# EAGLE design Schematic Final (EAGLE 9.2.2)
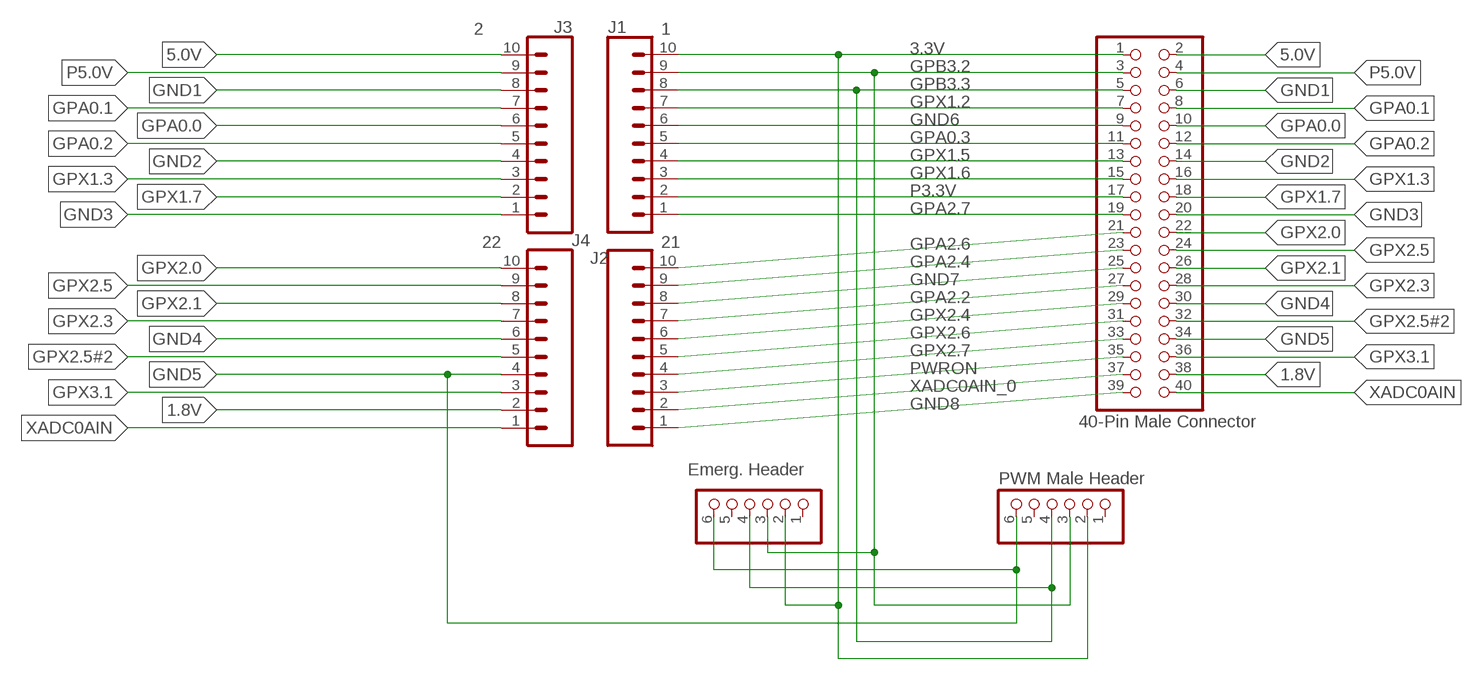
[diagram p0: schematic, sheet 1]

## Parts
J1  1  CONN_10"  [1X10]
J2  21  CONN_10"  [1X10]
J3  2  CONN_10"  [1X10]
J4  22  CONN_10"  [1X10]
JP1  40-Pin Male Connector  PINHD-2X20  [2X20]
JP2  Emerg. Header  PINHD-1X6  [1X06]
JP4  PWM Male Header  PINHD-1X6  [1X06]

## Nets
1.8V: J4.2 JP1.38
3.3V: J1.10 JP1.1 JP2.2 JP4.2
5.0V: J3.10 JP1.2
GND1: J3.8 JP1.6
GND2: J3.4 JP1.14
GND3: J3.1 JP1.20
GND4: J4.6 JP1.30
GND5: J4.4 JP1.34 JP2.6 JP4.6
GND6: J1.6 JP1.9
GND7: J2.8 JP1.25
GND8: J2.1 JP1.39
GPA0.0: J3.6 JP1.10
GPA0.1: J3.7 JP1.8
GPA0.2: J3.5 JP1.12
GPA0.3: J1.5 JP1.11
GPA2.2: J2.7 JP1.27
GPA2.4: J2.9 JP1.23
GPA2.6: J2.10 JP1.21
GPA2.7: J1.1 JP1.19
GPB3.2: J1.9 JP1.3 JP2.3 JP4.3
GPB3.3: J1.8 JP1.5 JP2.4 JP4.4
GPX1.2: J1.7 JP1.7
GPX1.3: J3.3 JP1.16
GPX1.5: J1.4 JP1.13
GPX1.6: J1.3 JP1.15
GPX1.7: J3.2 JP1.18
GPX2.0: J4.10 JP1.22
GPX2.1: J4.8 JP1.26
GPX2.3: J4.7 JP1.28
GPX2.4: J2.6 JP1.29
GPX2.5: J4.9 JP1.24
GPX2.5#2: J4.5 JP1.32
GPX2.6: J2.5 JP1.31
GPX2.7: J2.4 JP1.33
GPX3.1: J4.3 JP1.36
P3.3V: J1.2 JP1.17
P5.0V: J3.9 JP1.4
PWRON: J2.3 JP1.35
XADC0AIN: J4.1 JP1.40
XADC0AIN_0: J2.2 JP1.37
Unconnected: JP2.1 JP2.5 JP4.1 JP4.5

## Library data of the parts
J1-J4 = SparkFun-Connectors:CONN_10: Multi connection point. Often used as Generic Header-pin footprint for 0.1 inch spaced/style header connections On any of the 0.1 inch spaced packages, you can populate with these: Break Away Headers - Straight <https://www.sparkfun.com/products/116> (PRT-00116) Break Away Male Headers - Right Angle <https://www.sparkfun.com/products/553> (PRT-00553) Female Headers <https://www.sparkfun.com/products/115> (PRT-00115) Break Away Headers - Machine Pin <https://www.sparkfun.com/products/117> (PRT-00117) Break Away Female Headers - Swiss Machine Pin <https://www.sparkfun.com/products/743> (PRT-00743) Arduino Stackable Header - 10 Pin <https://www.sparkfun.com/products/11376> (PRT-11376) For SCREWTERMINALS and SPRING TERMINALS visit here: Screw Terimnals on SparkFun.com <https://www.sparkfun.com/search/results?term=Screw+Terminals> (5mm/3.5mm/2.54mm spacing) This device is also useful as a general connection point to wire up your design to another part of your project. Our various solder wires solder well into these plated through hole pads. Hook-Up Wire - Assortment (Stranded, 22 AWG) <https://www.sparkfun.com/products/11375> (PRT-11375) Hook-Up Wire - Assortment (Solid Core, 22 AWG) <https://www.sparkfun.com/products/11367> (PRT-11367) View the entire wire category on our website here <https://www.sparkfun.com/categories/141> Special notes: Molex polarized connector foot print use with SKU : PRT-08231 with associated crimp pins and housings. 1MM SMD Version SKU: PRT-10208 NOTES ON THE VARIANTS LOCK and LOCK_LONGPADS... This footprint was designed to help hold the alignment of a through-hole component (i.e. 6-pin header) while soldering it into place. You may notice that each hole has been shifted either up or down by 0.005 of an inch from it's more standard position (which is a perfectly straight line). This slight alteration caused the pins (the squares in the middle) to touch the edges of the holes. Because they are alternating, it causes a "brace" to hold the component in place. 0.005 has proven to be the perfect amount of "off-center" position when using our standard breakaway headers. Although looks a little odd when you look at the bare footprint, once you have a header in there, the alteration is very hard to notice. Also,if you push a header all the way into place, it is covered up entirely on the bottom side.; PROD_ID: CONN-11563
JP1 = pinhead:PINHD-2X20: PIN HEADER
JP2 JP4 = pinhead:PINHD-1X6: PIN HEADER

## Net classes
0 default: width 0.305 mm, drill 0.508 mm, clearance 0.254 mm

## Board
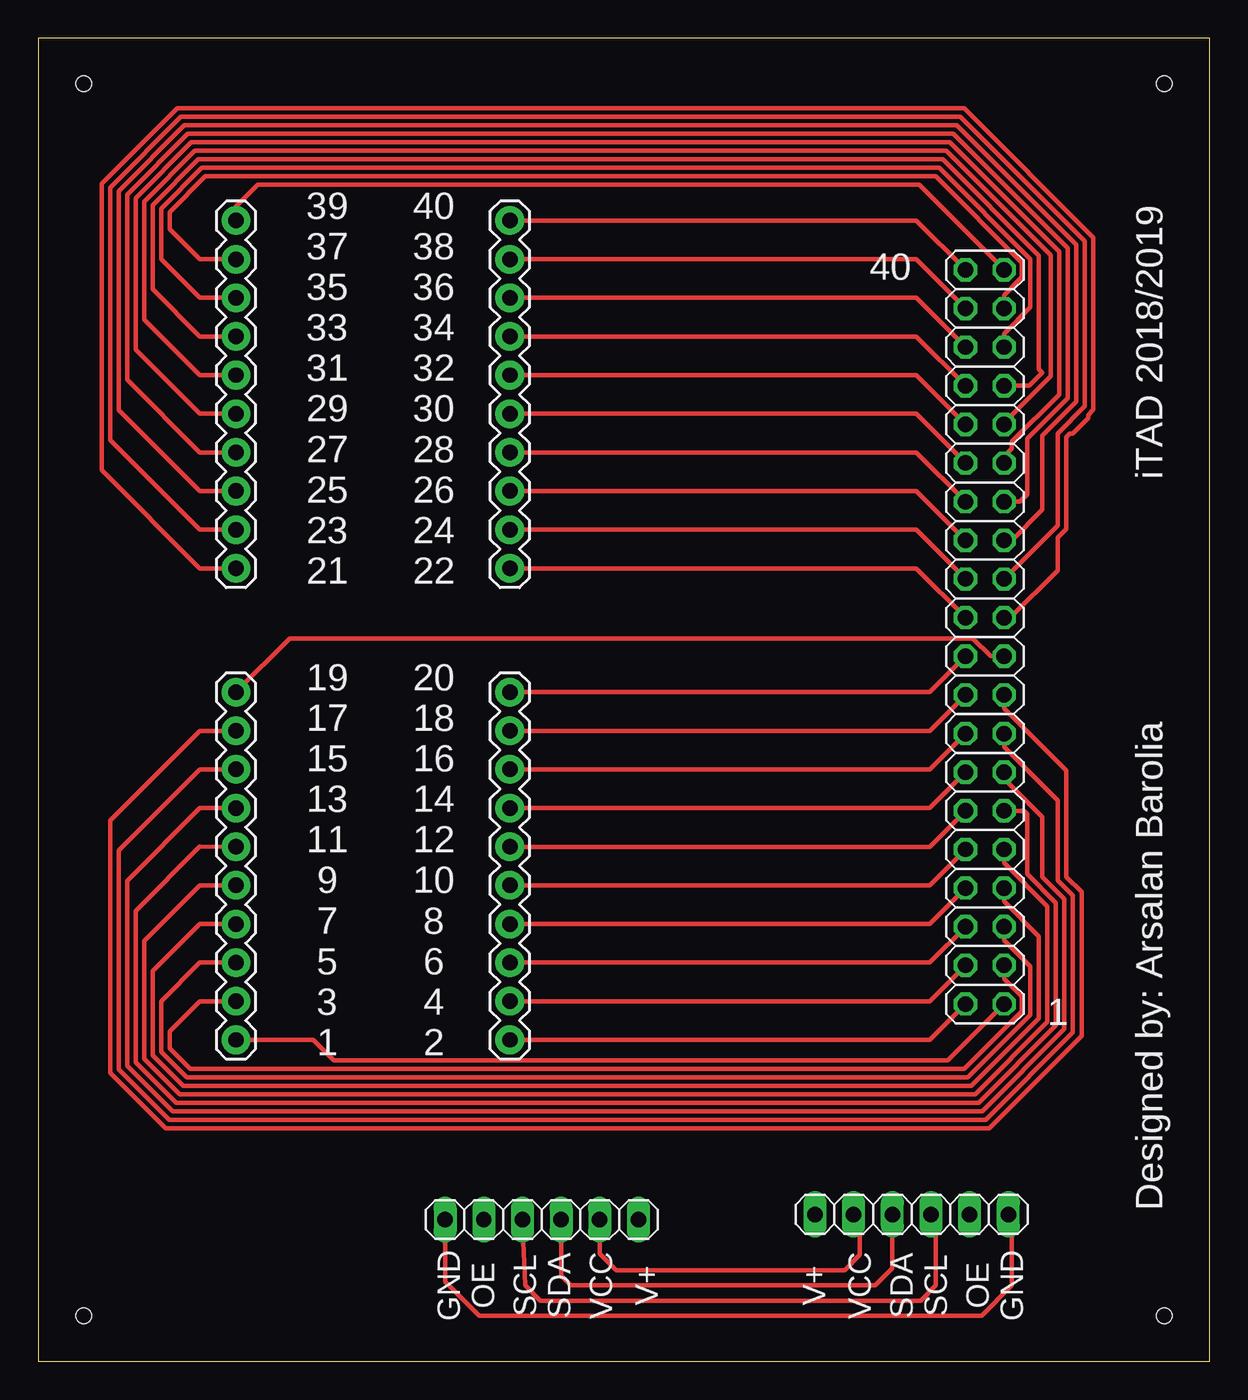
[diagram p1: board, top side]
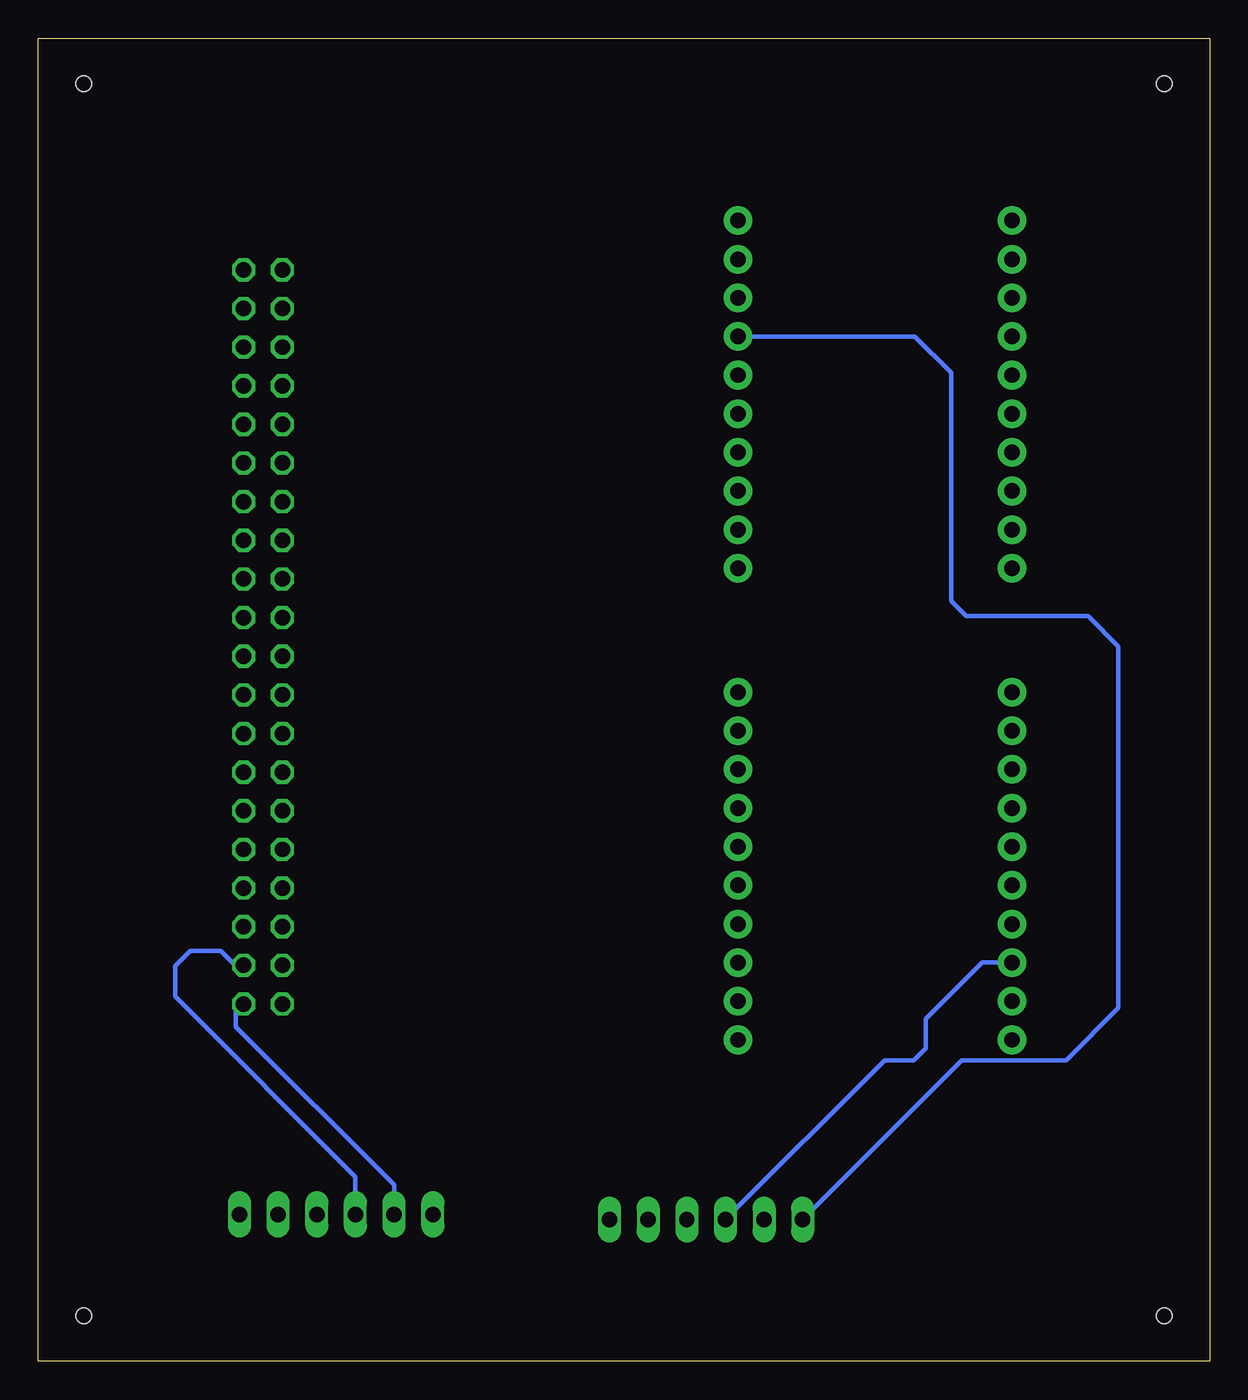
[diagram p2: board, bottom side, seen from below]

Size 77 x 87 mm. Coordinates in mm from the lower left corner, seen from the top.
Outline: 0,0 77,0 77,87 0,87 0,0
Copper layers (1*16): Top 0.035mm / dielectric 1.5mm / Bottom 0.035mm
Design rules "default": minimum track width 6mil, minimum drill 0.35mm, track to track 6mil, track to pad 6mil, pad to pad 6mil, via to via 6mil, smd to smd 6mil, copper to edge 40mil, drill to drill 6mil, minimum pad ring 10mil, minimum via ring 8mil, stop-mask expansion 4mil, vias tented up to drill 0mil, thermal gap 10mil
Holes 1 mm at 3,84 74,84 74,3 3,3

### Footprints (pad centres in the part's own frame; a part is rotated, then mirrored left to right if it is on the bottom)
1X10 = drill 1.016 pad 1.88: 1 0,0; 2 2.54,0; 3 5.08,0; 4 7.62,0; 5 10.16,0; 6 12.7,0; 7 15.24,0; 8 17.78,0; 9 20.32,0; 10 22.86,0
2X20 = drill 1.016 octagon: 1 -24.13,-1.27; 2 -24.13,1.27; 3 -21.59,-1.27; 4 -21.59,1.27; 5 -19.05,-1.27; 6 -19.05,1.27; 7 -16.51,-1.27; 8 -16.51,1.27; 9 -13.97,-1.27; 10 -13.97,1.27; 11 -11.43,-1.27; 12 -11.43,1.27; 13 -8.89,-1.27; 14 -8.89,1.27; 15 -6.35,-1.27; 16 -6.35,1.27; 17 -3.81,-1.27; 18 -3.81,1.27; 19 -1.27,-1.27; 20 -1.27,1.27; 21 1.27,-1.27; 22 1.27,1.27; 23 3.81,-1.27; 24 3.81,1.27; 25 6.35,-1.27; 26 6.35,1.27; 27 8.89,-1.27; 28 8.89,1.27; 29 11.43,-1.27; 30 11.43,1.27; 31 13.97,-1.27; 32 13.97,1.27; 33 16.51,-1.27; 34 16.51,1.27; 35 19.05,-1.27; 36 19.05,1.27; 37 21.59,-1.27; 38 21.59,1.27; 39 24.13,-1.27; 40 24.13,1.27
1X06 = drill 1.016 long: 1 -6.35,0; 2 -3.81,0; 3 -1.27,0; 4 1.27,0; 5 3.81,0; 6 6.35,0

### Placement (x,y rotation side)
J1  13,44 270 top
J2  13,75 270 top
J3  31,44 270 top
J4  31,75 270 top
JP1  62.22,47.63 90 top
JP2  33.1,9.33 180 top
JP4  57.41,9.67 0 top

### Tracks (layer width: path | path; a pad name or v marks a point on that pad's centre or on a via)
1.8V
  Top 0.305: J4.2 57.71,72.46 JP1.38
3.3V
  Top 0.305: J1.10 18.1,21.14 19.44,19.79 59.78,19.79 JP1.1 | JP2.2 36.91,7.09 38,6 53,6 54,7 54,9.27 JP4.2
  Bottom 0.305: JP4.2 53.6,11.6 64,22 64,22.99 JP1.1
5.0V
  Top 0.305: J3.10 58.59,21.14 JP1.2
GND1
  Top 0.305: J3.8 58.59,26.22 JP1.6
GND2
  Top 0.305: J3.4 58.59,36.38 JP1.14
GND3
  Top 0.305: J3.1 58.59,44 JP1.20
GND4
  Top 0.305: J4.6 57.71,62.3 JP1.30
GND5
  Top 0.305: J4.4 57.71,67.38 JP1.34 | JP2.6 26.75,5.25 29,3 62,3 64,5 64,9.43 JP4.6
  Bottom 0.305: JP2.6 16.29,19.79 9.44,19.79 6,23.24 6,47 8,49 16,49 17,50 17,65 19.38,67.38 J4.4
GND6
  Top 0.305: J1.6 10.64,31.3 6.98,27.64 6.98,19.89 9.31,17.56 61.57,17.56 66.33,22.32 66.33,29.93 63.49,32.77 JP1.9
GND7
  Top 0.305: J2.8 10.64,57.22 5.3,62.55 5.3,76.95 9.61,81.26 60.39,81.26 68.23,73.41 68.23,63.11 66,60.88 66,56 63.98,53.98 JP1.25
GND8
  Top 0.305: J2.1 13,75.9 14.44,77.35 57.9,77.35 JP1.39
GPA0.0
  Top 0.305: J3.6 58.59,31.3 JP1.10
GPA0.1
  Top 0.305: J3.7 58.59,28.76 JP1.8
GPA0.2
  Top 0.305: J3.5 58.59,33.84 JP1.12
GPA0.3
  Top 0.305: J1.5 10.64,33.84 6.42,29.62 6.42,19.66 9.07,17 61.8,17 66.89,22.09 66.89,30.16 65,32.05 65,36 64.8,36.2 JP1.11
GPA2.2
  Top 0.305: J2.7 10.64,59.76 5.86,64.54 5.86,76.72 9.84,80.7 60.16,80.7 67.68,73.18 67.68,63.34 65,60.67 65,57 64.52,56.52 JP1.27
GPA2.4
  Top 0.305: J2.9 10.64,54.68 4.74,60.57 4.74,77.18 9.38,81.82 60.62,81.82 68.79,73.64 68.79,62.79 67,61 67,54.95 JP1.23
GPA2.6
  Top 0.305: J2.10 10.64,52.14 4.18,58.59 4.18,77.41 9.15,82.38 60.85,82.38 69.35,73.87 69.35,62.56 69,62.21 69,62 68,61 67.79,61 67.56,60.77 67.56,54.72 67,54.16 67,52 63.9,48.9 JP1.21
GPA2.7
  Top 0.305: JP1.19 62.6,46.36 61.43,47.53 16.53,47.53 J1.1
GPB3.2
  Top 0.305: J1.9 10.64,23.68 8.65,21.7 8.65,20.58 10,19.23 60.88,19.23 64.66,23.02 64.66,23.98 63.49,25.15 JP1.3 | JP2.3 34.37,5.63 35,5 55,5 56.14,6.14 JP4.3
  Bottom 0.305: JP4.3 56.14,12.14 68,24 68,26 67,27 65,27 64.04,26.04 JP1.3
GPB3.3
  Top 0.305: J1.8 10.64,26.22 8.1,23.68 8.1,20.35 9.77,18.68 61.11,18.68 65.22,22.79 65.22,25.96 63.49,27.69 JP1.5 | JP2.4 32,5 33,4 58,4 59,5 59,9 JP4.4
  Bottom 0.305: J1.8 14.94,26.22 18.65,22.51 18.65,20.58 19.44,19.79 21.37,19.79 JP2.4
GPX1.2
  Top 0.305: J1.7 10.64,28.76 7.54,25.66 7.54,20.12 9.54,18.12 61.34,18.12 65.78,22.55 65.78,27.95 63.49,30.23 JP1.7
GPX1.3
  Top 0.305: J3.3 58.59,38.92 JP1.16
GPX1.5
  Top 0.305: J1.4 10.64,36.38 5.86,31.6 5.86,19.43 8.84,16.44 62.03,16.44 67.45,21.86 67.45,30.39 66,31.84 66,35.79 63.49,38.3 JP1.13
GPX1.6
  Top 0.305: J1.3 10.64,38.92 5.3,33.59 5.3,19.19 8.61,15.88 62.27,15.88 68.01,21.63 68.01,30.62 67,31.63 67,36.88 63.49,40.39 JP1.15
GPX1.7
  Top 0.305: J3.2 58.59,41.46 JP1.18
GPX2.0
  Top 0.305: J4.10 57.71,52.14 JP1.22
GPX2.1
  Top 0.305: J4.8 57.71,57.22 JP1.26
GPX2.3
  Top 0.305: J4.7 57.71,59.76 JP1.28
GPX2.4
  Top 0.305: J2.6 10.64,62.3 6.42,66.52 6.42,76.48 10.07,80.14 59.92,80.14 67.12,72.95 67.12,63.58 64,60.46 64,60 63.49,59.49 JP1.29
GPX2.5
  Top 0.305: J4.9 57.71,54.68 JP1.24
GPX2.5#2
  Top 0.305: J4.5 57.71,64.84 JP1.32
GPX2.6
  Top 0.305: J2.5 10.64,64.84 6.98,68.5 6.98,76.25 10.31,79.58 59.69,79.58 66.56,72.71 66.56,64.77 64,62.21 64,62 63.6,61.6 JP1.31
GPX2.7
  Top 0.305: J2.4 10.64,67.38 7.54,70.48 7.54,76.02 10.54,79.02 59.46,79.02 65.78,72.71 65.78,65.22 66,65 65.14,64.14 JP1.33
GPX3.1
  Top 0.305: J4.3 57.71,69.92 JP1.36
P3.3V
  Top 0.305: J1.2 10.64,41.46 4.74,35.57 4.74,18.96 8.38,15.32 62.5,15.32 68.57,21.4 68.57,30.85 67.56,31.86 67.56,38.86 63.49,42.93 JP1.17
P5.0V
  Top 0.305: J3.9 58.59,23.68 JP1.4
PWRON
  Top 0.305: J2.3 10.64,69.92 8.1,72.46 8.1,75.79 10.77,78.46 59.23,78.46 65.22,72.47 65.22,69.3 63.49,67.57 JP1.35
XADC0AIN
  Top 0.305: J4.1 57.71,75 JP1.40
XADC0AIN_0
  Top 0.305: J2.2 10.64,72.46 8.65,74.44 8.65,75.56 11,77.91 59,77.91 64.66,72.24 64.66,71.28 63.49,70.11 JP1.37

### Text on the board
tPlace: 40 | iTAD 2018/2019 | 39 / 37 / 35 / 33 / 31 / 29 / 27 / 25 / 23 / 21 | 40 / 38 / 36 / 34 / 32 / 30 / 28 / 26 / 24 / 22 | 19 / 17 / 15 / 13 / 11 / 9 / 7 / 5 / 3 / 1 | 20 / 18 / 16 / 14 / 12 / 10 / 8 / 6 / 4 / 2 | Designed by: Arsalan Barolia | 1 | GND | OE | SCL | SDA | VCC | V+ | V+ | VCC | SDA | SCL | OE | GND